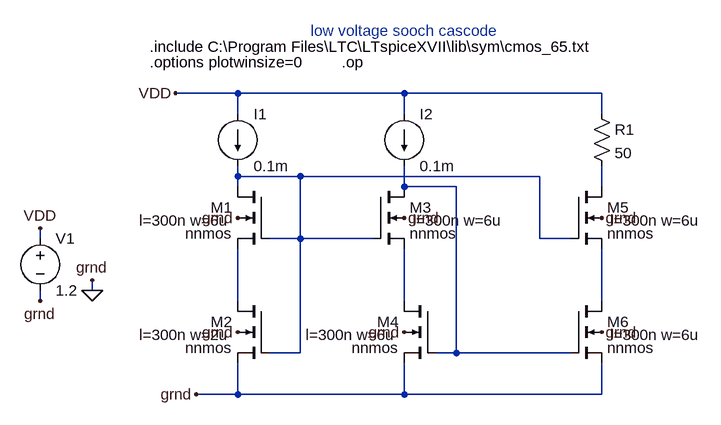
[diagram p0: schematic lvs mirror.asc]
lvs mirror.asc, the LTspice schematic file:
Version 4
SHEET 1 880 680
WIRE -32 -944 -128 -944
WIRE 224 -944 -32 -944
WIRE 528 -944 224 -944
WIRE -32 -912 -32 -944
WIRE 224 -912 224 -944
WIRE 528 -912 528 -944
WIRE -32 -816 -32 -832
WIRE 64 -816 -32 -816
WIRE 432 -816 64 -816
WIRE -32 -800 -32 -816
WIRE 224 -800 224 -832
WIRE 304 -800 224 -800
WIRE 528 -800 528 -832
WIRE -336 -720 -336 -736
WIRE 64 -720 64 -816
WIRE 64 -720 16 -720
WIRE 176 -720 64 -720
WIRE 432 -720 432 -816
WIRE 480 -720 432 -720
WIRE -256 -640 -256 -656
WIRE -336 -624 -336 -640
WIRE -32 -624 -32 -704
WIRE 224 -624 224 -704
WIRE 528 -624 528 -704
WIRE 64 -544 64 -720
WIRE 64 -544 16 -544
WIRE 304 -544 304 -800
WIRE 304 -544 272 -544
WIRE 480 -544 304 -544
WIRE -32 -480 -32 -528
WIRE -32 -480 -96 -480
WIRE 224 -480 224 -528
WIRE 224 -480 -32 -480
WIRE 528 -480 528 -528
WIRE 528 -480 224 -480
FLAG -256 -640 0
FLAG -256 -656 grnd
FLAG -336 -624 grnd
FLAG -336 -736 VDD
FLAG -128 -944 VDD
FLAG -96 -480 grnd
FLAG -32 -752 grnd
FLAG -32 -576 grnd
FLAG 224 -576 grnd
FLAG 224 -752 grnd
FLAG 528 -752 grnd
FLAG 528 -576 grnd
SYMBOL nmos4 16 -800 M0
WINDOW 123 61 52 Left 2
SYMATTR InstName M1
SYMATTR Value nnmos
SYMATTR Value2 l=300n w=6u
SYMBOL nmos4 16 -624 M0
WINDOW 123 61 52 Left 2
SYMATTR InstName M2
SYMATTR Value nnmos
SYMATTR Value2 l=300n w=2u
SYMBOL nmos4 176 -800 R0
WINDOW 123 61 52 Left 2
SYMATTR InstName M3
SYMATTR Value nnmos
SYMATTR Value2 l=300n w=6u
SYMBOL nmos4 272 -624 M0
WINDOW 123 61 52 Left 2
SYMATTR InstName M4
SYMATTR Value nnmos
SYMATTR Value2 l=300n w=6u
SYMBOL nmos4 480 -800 R0
WINDOW 123 61 52 Left 2
SYMATTR InstName M5
SYMATTR Value nnmos
SYMATTR Value2 l=300n w=6u
SYMBOL nmos4 480 -624 R0
WINDOW 123 61 52 Left 2
SYMATTR InstName M6
SYMATTR Value nnmos
SYMATTR Value2 l=300n w=6u
SYMBOL voltage -336 -736 R0
WINDOW 123 0 0 Left 0
WINDOW 39 0 0 Left 0
SYMATTR InstName V1
SYMATTR Value 1.2
SYMBOL current -32 -912 R0
WINDOW 123 0 0 Left 0
WINDOW 39 0 0 Left 0
SYMATTR InstName I1
SYMATTR Value 0.1m
SYMBOL current 224 -912 R0
WINDOW 123 0 0 Left 0
WINDOW 39 0 0 Left 0
SYMATTR InstName I2
SYMATTR Value 0.1m
SYMBOL res 512 -928 R0
SYMATTR InstName R1
SYMATTR Value 50
TEXT 80 -1040 Left 2 ;low voltage sooch cascode
TEXT -168 -1016 Left 2 !.include C:\\Program Files\\LTC\\LTspiceXVII\\lib\\sym\\cmos_65.txt
TEXT -168 -992 Left 2 !.options plotwinsize=0
TEXT 128 -992 Left 2 !.op

The netlist it stands for:
* lvs mirror.asc
M1 N001 N001 N004 0 nnmos l=300n w=6u
M2 N004 N001 0 0 nnmos l=300n w=2u
M3 N002 N001 N005 0 nnmos l=300n w=6u
M4 N005 N002 0 0 nnmos l=300n w=6u
M5 N003 N001 N006 0 nnmos l=300n w=6u
M6 N006 N002 0 0 nnmos l=300n w=6u
V1 VDD 0 1.2
I1 VDD N001 0.1m
I2 VDD N002 0.1m
R1 VDD N003 50
.model NMOS NMOS
.model PMOS PMOS
.lib standard.mos
* low voltage sooch cascode
.include C:\Program Files\LTC\LTspiceXVII\lib\sym\cmos_65.txt
.options plotwinsize=0
.op
.backanno
.end